# EAGLE design logic (EAGLE 6.2)
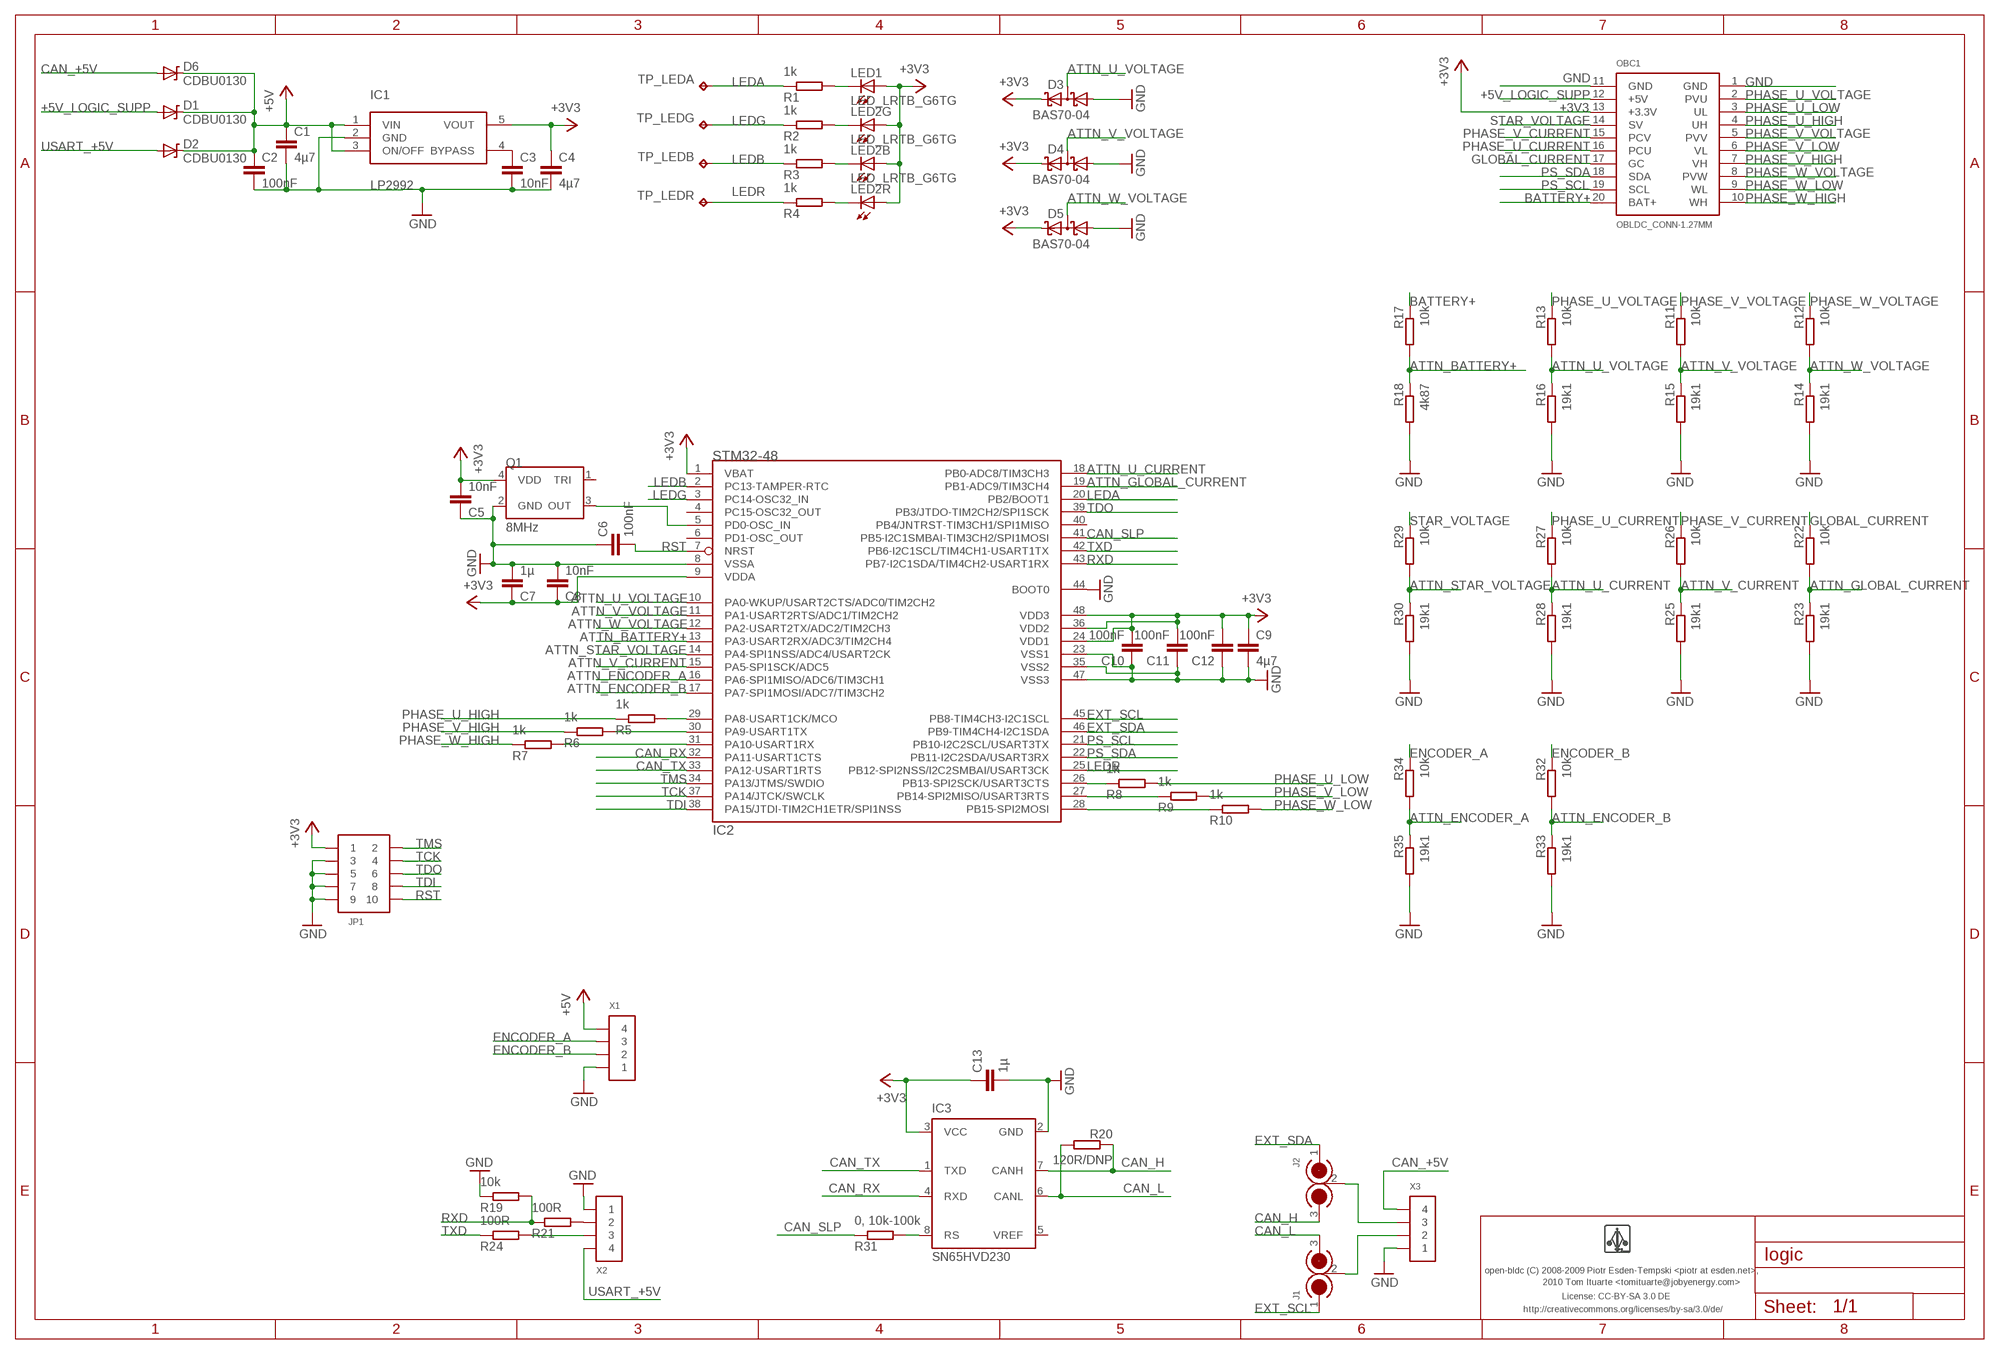
[diagram p0: schematic, sheet 1]

## Parts
C1  4µ7  CAPACITOR-0603  [0603-CAP]
C2  100nF  CAPACITOR-0603  [0603-CAP]
C3  10nF  CAPACITOR-0603  [0603-CAP]
C4  4µ7  CAPACITOR-0603  [0603-CAP]
C5  10nF  CAPACITOR-0603  [0603-CAP]
C6  100nF  CAPACITOR-0603  [0603-CAP]
C7  1µ  CAPACITOR-0603  [0603-CAP]
C8  10nF  CAPACITOR-0603  [0603-CAP]
C9  4µ7  CAPACITOR-0603  [0603-CAP]
C10  100nF  CAPACITOR-0603  [0603-CAP]
C11  100nF  CAPACITOR-0603  [0603-CAP]
C12  100nF  CAPACITOR-0603  [0603-CAP]
C13  1µ  CAPACITOR-0603  [0603-CAP]
D1  CDBU0130  DIODE-ZENER-0603  [0603-LED]
D2  CDBU0130  DIODE-ZENER-0603  [0603-LED]
D3  BAS70-04  [SOT23]
D4  BAS70-04  [SOT23]
D5  BAS70-04  [SOT23]
D6  CDBU0130  DIODE-ZENER-0603  [0603-LED]
IC1  LP2992  [SOT23-5]
IC2  STM32-48  [LQFP48]
IC3  SN65HVD230  [SO8]
J1  CIRC_JMP_2  [CIRC_JMP_2]
J2  CIRC_JMP_2  [CIRC_JMP_2]
JP1  PIN_HDR_EDG_1.27MM_5-2-DH  [PIN_HDR_1.27MM_SMD_DH_10]
LED1  AMBER  LED-0603  [0603-LED]
LED2  LED_LRTB_G6TG  [PLCC6]
OBC1  OBLDC_CONN-1.27MM  [OBLDC_CONN]
Q1  8MHz  ASE_ASCILLATOR  [ASE_OSCILLATOR]
R1  1k  RESISTOR-0603  [0603-RES]
R2  1k  RESISTOR-0603  [0603-RES]
R3  1k  RESISTOR-0603  [0603-RES]
R4  1k  RESISTOR-0603  [0603-RES]
R5  1k  RESISTOR-0603  [0603-RES]
R6  1k  RESISTOR-0603  [0603-RES]
R7  1k  RESISTOR-0603  [0603-RES]
R8  1k  RESISTOR-0603  [0603-RES]
R9  1k  RESISTOR-0603  [0603-RES]
R10  1k  RESISTOR-0603  [0603-RES]
R11  10k  RESISTOR-0603  [0603-RES]
R12  10k  RESISTOR-0603  [0603-RES]
R13  10k  RESISTOR-0603  [0603-RES]
R14  19k1  RESISTOR-0603  [0603-RES]
R15  19k1  RESISTOR-0603  [0603-RES]
R16  19k1  RESISTOR-0603  [0603-RES]
R17  10k  RESISTOR-0603  [0603-RES]
R18  4k87  RESISTOR-0603  [0603-RES]
R19  10k  RESISTOR-0603  [0603-RES]
R20  120R/DNP  RESISTOR-0603  [0603-RES]
R21  100R  RESISTOR-0603  [0603-RES]
R22  10k  RESISTOR-0603  [0603-RES]
R23  19k1  RESISTOR-0603  [0603-RES]
R24  100R  RESISTOR-0603  [0603-RES]
R25  19k1  RESISTOR-0603  [0603-RES]
R26  10k  RESISTOR-0603  [0603-RES]
R27  10k  RESISTOR-0603  [0603-RES]
R28  19k1  RESISTOR-0603  [0603-RES]
R29  10k  RESISTOR-0603  [0603-RES]
R30  19k1  RESISTOR-0603  [0603-RES]
R31  0, 10k-100k  RESISTOR-0603  [0603-RES]
R32  10k  RESISTOR-0603  [0603-RES]
R33  19k1  RESISTOR-0603  [0603-RES]
R34  10k  RESISTOR-0603  [0603-RES]
R35  19k1  RESISTOR-0603  [0603-RES]
TP_LEDA  TP-SMD  [MINI_TESTPAD]
TP_LEDB  TP-SMD  [MINI_TESTPAD]
TP_LEDG  TP-SMD  [MINI_TESTPAD]
TP_LEDR  TP-SMD  [MINI_TESTPAD]
U$1  LOGO  LOGO-NORM  [LOGO]
X1  CONN_4-1-53261  [PB-53261-04]
X2  CONN_4-1-53261  [PB-53261-04]
X3  CONN_4-1-53261  [PB-53261-04]

## Nets
+3V3: C4.P$1 C5.P$2 C7.P$1 C8.P$1 C9.P$1 C10.P$2 C11.P$2 C12.P$2 C13.P$1 D3.2(C2) D4.2(C2) D5.2(C2) IC1.5(VOUT) IC2.1(VBAT) IC2.9(VDDA) IC2.24(VDD1) IC2.36(VDD2) IC2.48(VDD3) IC3.3(VCC) JP1.1 LED1.A LED2.A1(R:A) LED2.A2(G:A) LED2.A3(B:A) OBC1.13(+3.3V) Q1.4(VDD)
+5V: C1.P$1 C2.P$1 D1.C D2.C D6.C IC1.1(VIN) IC1.3(ON/OFF) X1.4
+5V_LOGIC_SUPP: D1.A OBC1.12(+5V)
ATTN_BATTERY+: IC2.13(PA3-USART2RX/ADC3/TIM2CH4) R17.P$2 R18.P$1
ATTN_ENCODER_A: IC2.16(PA6-SPI1MISO/ADC6/TIM3CH1) R34.P$2 R35.P$1
ATTN_ENCODER_B: IC2.17(PA7-SPI1MOSI/ADC7/TIM3CH2) R32.P$2 R33.P$1
ATTN_GLOBAL_CURRENT: IC2.19(PB1-ADC9/TIM3CH4) R22.P$2 R23.P$1
ATTN_STAR_VOLTAGE: IC2.14(PA4-SPI1NSS/ADC4/USART2CK) R29.P$2 R30.P$1
ATTN_U_CURRENT: IC2.18(PB0-ADC8/TIM3CH3) R27.P$2 R28.P$1
ATTN_U_VOLTAGE: D3.3(C1A2) IC2.10(PA0-WKUP/USART2CTS/ADC0/TIM2CH2) R13.P$2 R16.P$1
ATTN_V_CURRENT: IC2.15(PA5-SPI1SCK/ADC5) R25.P$1 R26.P$2
ATTN_V_VOLTAGE: D4.3(C1A2) IC2.11(PA1-USART2RTS/ADC1/TIM2CH2) R11.P$2 R15.P$1
ATTN_W_VOLTAGE: D5.3(C1A2) IC2.12(PA2-USART2TX/ADC2/TIM2CH3) R12.P$2 R14.P$1
BATTERY+: OBC1.20(BAT+) R17.P$1
CAN_+5V: D6.A X3.4
CAN_H: IC3.7(CANH) J2.3 R20.P$1
CAN_L: IC3.6(CANL) J1.3 R20.P$2
CAN_RX: IC2.32(PA11-USART1CTS) IC3.4(RXD)
CAN_SLP: IC2.41(PB5-I2C1SMBAI-TIM3CH2/SPI1MOSI) R31.P$1
CAN_TX: IC2.33(PA12-USART1RTS) IC3.1(TXD)
ENCODER_A: R34.P$1 X1.3
ENCODER_B: R32.P$1 X1.2
EXT_SCL: IC2.45(PB8-TIM4CH3-I2C1SCL) J1.1
EXT_SDA: IC2.46(PB9-TIM4CH4-I2C1SDA) J2.1
GLOBAL_CURRENT: OBC1.17(GC) R22.P$1
GND: C1.P$2 C2.P$2 C3.P$2 C4.P$2 C5.P$1 C6.P$1 C7.P$2 C8.P$2 C9.P$2 C10.P$1 C11.P$1 C12.P$1 C13.P$2 D3.1(A1) D4.1(A1) D5.1(A1) IC1.2(GND) IC2.8(VSSA) IC2.23(VSS1) IC2.35(VSS2) IC2.44(BOOT0) IC2.47(VSS3) IC3.2(GND) JP1.3 JP1.5 JP1.7 JP1.9 OBC1.1(GND) OBC1.11(GND) Q1.2(GND) R14.P$2 R15.P$2 R16.P$2 R18.P$2 R19.P$1 R23.P$2 R25.P$2 R28.P$2 R30.P$2 R33.P$2 R35.P$2 X1.1 X2.1 X3.1
LEDA: IC2.20(PB2/BOOT1) R1.P$1 TP_LEDA.1(TP)
LEDB: IC2.2(PC13-TAMPER-RTC) R3.P$1 TP_LEDB.1(TP)
LEDG: IC2.3(PC14-OSC32_IN) R2.P$1 TP_LEDG.1(TP)
LEDR: IC2.25(PB12-SPI2NSS/I2C2SMBAI/USART3CK) R4.P$1 TP_LEDR.1(TP)
N$1: J2.2 X3.3
N$2: J1.2 X3.2
N$3: LED1.C R1.P$2
N$4: LED2.C1(R:C) R4.P$2
N$5: LED2.C3(B:C) R3.P$2
N$6: R21.P$2 X2.2
N$7: IC3.8(RS) R31.P$2
N$10: LED2.C2(G:C) R2.P$2
N$20: R24.P$2 X2.3
N$22: C3.P$1 IC1.4(BYPASS)
N$33: IC2.26(PB13-SPI2SCK/USART3CTS) R8.P$1
N$36: IC2.27(PB14-SPI2MISO/USART3RTS) R9.P$1
N$39: IC2.28(PB15-SPI2MOSI) R10.P$1
N$40: IC2.5(PD0-OSC_IN) Q1.3(OUT)
N$41: IC2.29(PA8-USART1CK/MCO) R5.P$2
N$42: IC2.30(PA9-USART1TX) R6.P$2
N$45: IC2.31(PA10-USART1RX) R7.P$2
PHASE_U_CURRENT: OBC1.16(PCU) R27.P$1
PHASE_U_HIGH: OBC1.4(UH) R5.P$1
PHASE_U_LOW: OBC1.3(UL) R8.P$2
PHASE_U_VOLTAGE: OBC1.2(PVU) R13.P$1
PHASE_V_CURRENT: OBC1.15(PCV) R26.P$1
PHASE_V_HIGH: OBC1.7(VH) R6.P$1
PHASE_V_LOW: OBC1.6(VL) R9.P$2
PHASE_V_VOLTAGE: OBC1.5(PVV) R11.P$1
PHASE_W_HIGH: OBC1.10(WH) R7.P$1
PHASE_W_LOW: OBC1.9(WL) R10.P$2
PHASE_W_VOLTAGE: OBC1.8(PVW) R12.P$1
PS_SCL: IC2.21(PB10-I2C2SCL/USART3TX) OBC1.19(SCL)
PS_SDA: IC2.22(PB11-I2C2SDA/USART3RX) OBC1.18(SDA)
RST: C6.P$2 IC2.7(NRST) JP1.10
RXD: IC2.43(PB7-I2C1SDA/TIM4CH2-USART1RX) R19.P$2 R21.P$1
STAR_VOLTAGE: OBC1.14(SV) R29.P$1
TCK: IC2.37(PA14/JTCK/SWCLK) JP1.4
TDI: IC2.38(PA15/JTDI-TIM2CH1ETR/SPI1NSS) JP1.8
TDO: IC2.39(PB3/JTDO-TIM2CH2/SPI1SCK) JP1.6
TMS: IC2.34(PA13/JTMS/SWDIO) JP1.2
TXD: IC2.42(PB6-I2C1SCL/TIM4CH1-USART1TX) R24.P$1
USART_+5V: D2.A X2.4
Unconnected: IC2.4(PC15-OSC32_OUT) IC2.6(PD1-OSC_OUT) IC2.40(PB4/JNTRST-TIM3CH1/SPI1MISO) IC3.5(VREF) Q1.1(TRI)

## Notes on the sheet
- open-bldc (C) 2008-2009 Piotr Esden-Tempski <piotr at esden.net>,
- 2010 Tom Ituarte <tomituarte@jobyenergy.com>
- License: CC-BY-SA 3.0 DE
- http://creativecommons.org/licenses/by-sa/3.0/de/

## Library data of the parts
C1-C13 = pel_dipol_comp:CAPACITOR
D1 D2 D6 = pel_dipol_comp:DIODE-ZENER
D3-D5 = diode:BAS70-04: Silicon Schottky Diodes General-purpose diode for high-speed switching
IC1 = open-bldc:LP2992
IC2 = open-bldc:STM32-48
IC3 = open-bldc:SN65HVD230: SN65HVD230 - 3.3V CAN Transceiver - 3.3V operation - ISO 11898 compliant - up to 1Mbps - up to 120 nodes - listen only mode - slope control
J1 J2 = fancy_jumpers:CIRC_JMP_2
JP1 = open-bldc:PIN_HDR_EDG_1.27MM_5-2
LED1 = pel_dipol_comp:LED
LED2 = open-bldc:LED_LRTB_G6TG
OBC1 = open-bldc:OBLDC_CONN
Q1 = open-bldc:ASE_ASCILLATOR
R1-R35 = pel_dipol_comp:RESISTOR
TP_LEDA TP_LEDB TP_LEDG TP_LEDR = open-bldc:TP
U$1 = open-bldc:LOGO
X1-X3 = pel_molex:CONN_4-1

## Board
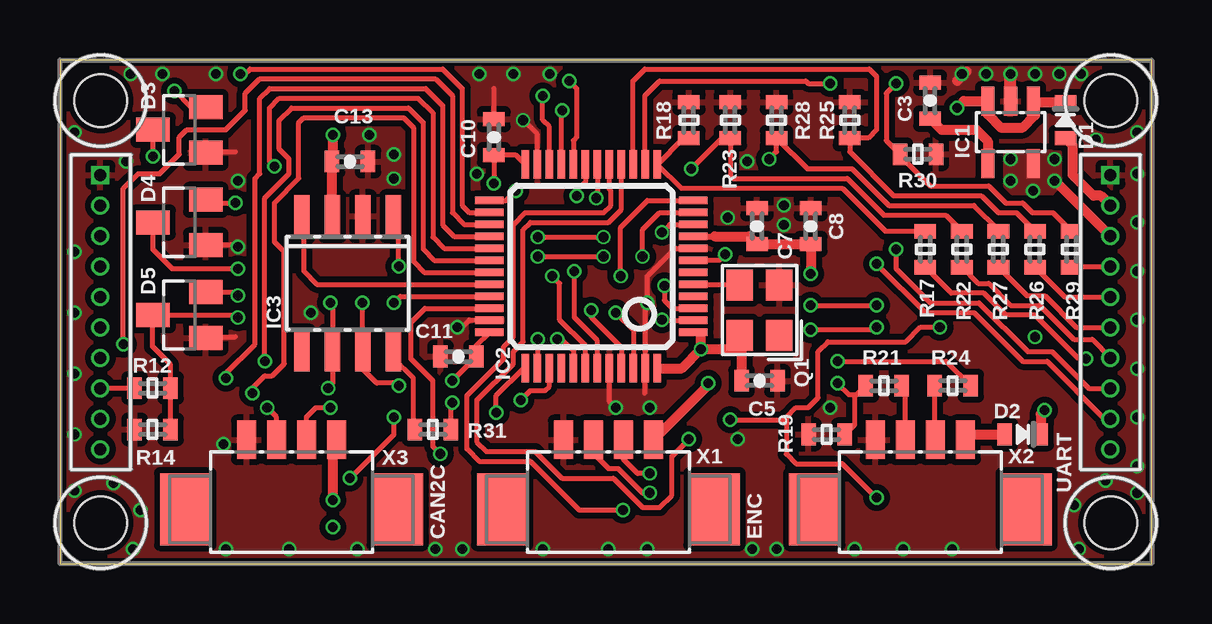
[diagram p1: board, top side]
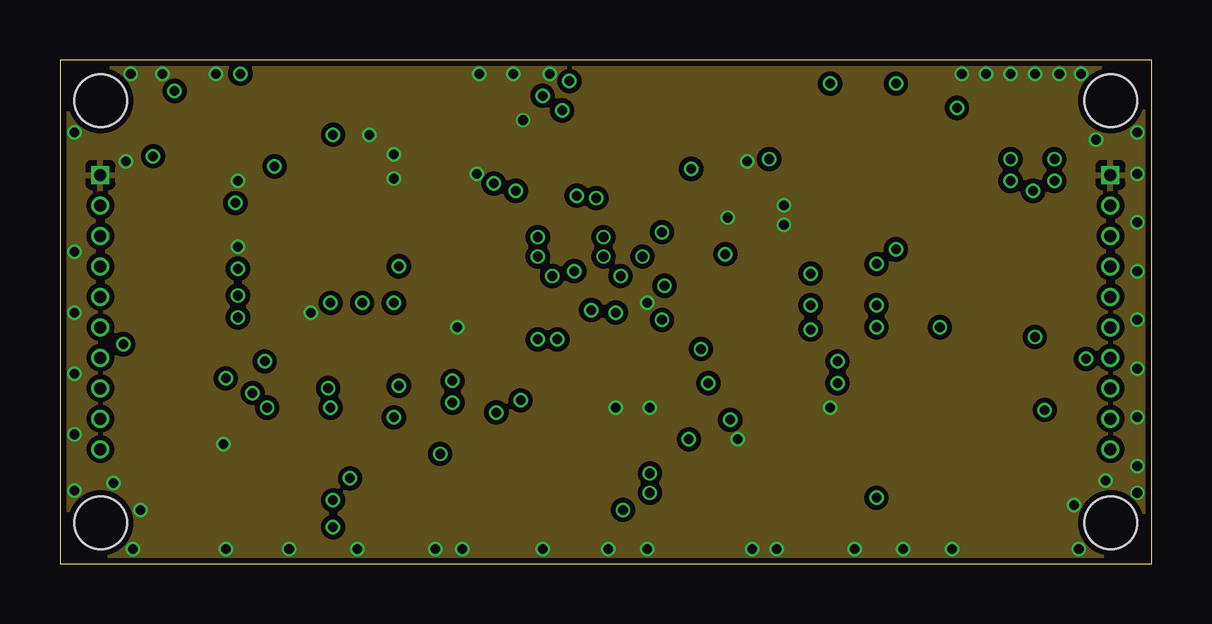
[diagram p2: board, inner layer Route2]
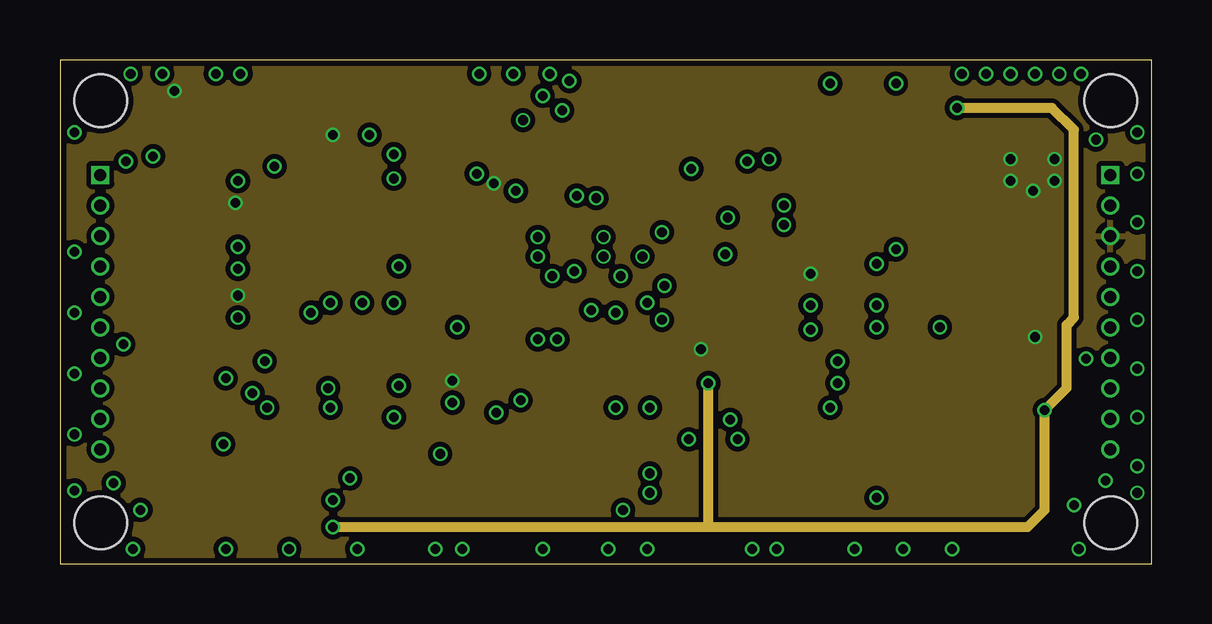
[diagram p3: board, inner layer Route15]
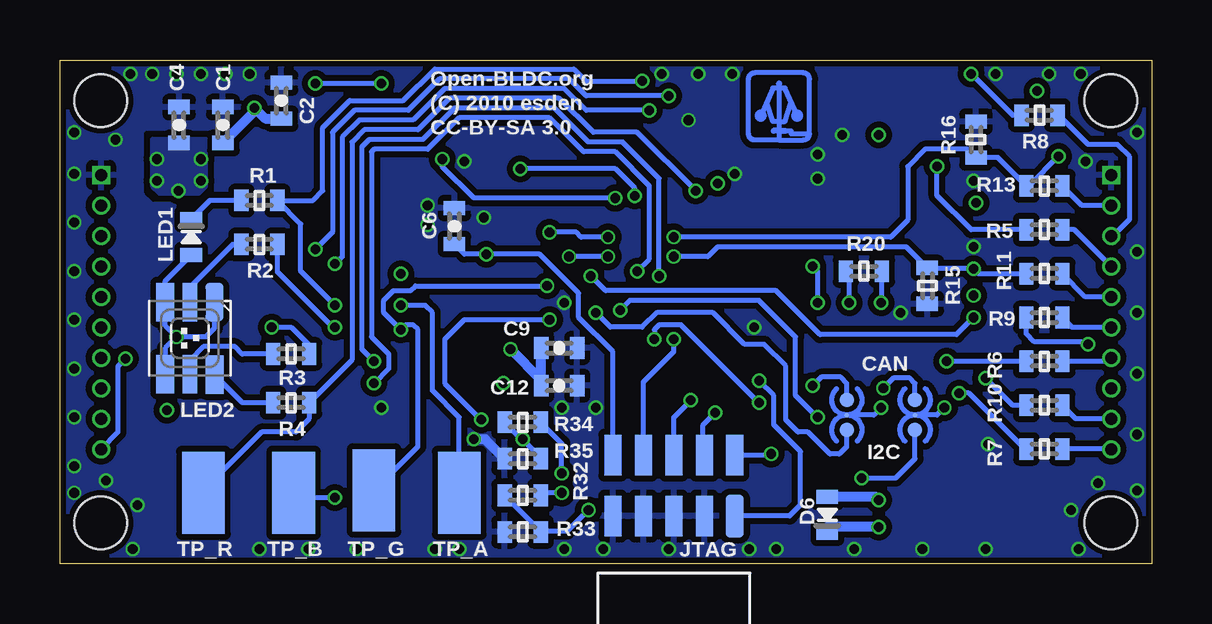
[diagram p4: board, bottom side, seen from below]

Size 45.5 x 21 mm. Coordinates in mm from the lower left corner, seen from the top.
Outline: 0,0 45.5,0 45.5,21 0,21 0,0
Copper layers (1*2+15*16): Top 0.035mm / dielectric 0.75mm / Route2 0.035mm / dielectric 0.15mm / Route15 0.035mm / dielectric 0.75mm / Bottom 0.035mm
Design rules: minimum track width 8mil, minimum drill 0.4mm, track to track 8mil, track to pad 8mil, pad to pad 8mil, via to via 8mil, smd to smd 8mil, copper to edge 10mil, drill to drill 8mil, minimum pad ring 0.1mm, minimum via ring 0.1mm, stop-mask expansion 4mil, vias tented up to drill 16mil, thermal gap 10mil

### Footprints (pad centres in the part's own frame; a part is rotated, then mirrored left to right if it is on the bottom)
0603-CAP = smd 0.6 x 0.9: P$1 -0.75,0; P$2 0.75,0
0603-LED = smd 0.6 x 0.9: A 0.75,0; C -0.75,0
SOT23 = smd 1 x 1.4: 1 -0.95,-1.1; 2 0.95,-1.1; 3 0,1.1
SOT23-5 = smd 0.55 x 1.2: 1 -0.95,-1.3; 2 0,-1.3; 3 0.95,-1.3; 4 0.95,1.3; 5 -0.95,1.3
LQFP48 = smd 0.3 x 1.2: 1 -2.75,-4.25; 2 -2.25,-4.25; 3 -1.75,-4.25; 4 -1.25,-4.25; 5 -0.75,-4.25; 6 -0.25,-4.25; 7 0.25,-4.25; 8 0.75,-4.25; 9 1.25,-4.25; 10 1.75,-4.25; 11 2.25,-4.25; 12 2.75,-4.25; 25 2.75,4.25; 26 2.25,4.25; 27 1.75,4.25; 28 1.25,4.25; 29 0.75,4.25; 30 0.25,4.25; 31 -0.25,4.25; 32 -0.75,4.25; 33 -1.25,4.25; 34 -1.75,4.25; 35 -2.25,4.25; 36 -2.75,4.25 | smd 1.2 x 0.3: 13 4.25,-2.75; 14 4.25,-2.25; 15 4.25,-1.75; 16 4.25,-1.25; 17 4.25,-0.75; 18 4.25,-0.25; 19 4.25,0.25; 20 4.25,0.75; 21 4.25,1.25; 22 4.25,1.75; 23 4.25,2.25; 24 4.25,2.75; 37 -4.25,2.75; 38 -4.25,2.25; 39 -4.25,1.75; 40 -4.25,1.25; 41 -4.25,0.75; 42 -4.25,0.25; 43 -4.25,-0.25; 44 -4.25,-0.75; 45 -4.25,-1.25; 46 -4.25,-1.75; 47 -4.25,-2.25; 48 -4.25,-2.75
SO8 = smd 0.65 x 1.75: 1 -1.905,-2.8; 2 -0.635,-2.8; 3 0.635,-2.8; 4 1.905,-2.8; 5 1.905,2.8; 6 0.635,2.8; 7 -0.635,2.8; 8 -1.905,2.8
CIRC_JMP_2 = smd 0.61 x 0.61: 1 0,-0.617; 3 0,0.617 | smd 0.203 x 0.203: 2 0,0
PIN_HDR_1.27MM_SMD_DH_10 = smd 1.78 x 0.76: 1 -1.27,-2.54 | smd 1.702 x 0.711: 2 1.27,-2.54; 3 -1.27,-1.27; 4 1.27,-1.27; 5 -1.27,0; 6 1.27,0; 7 -1.27,1.27; 8 1.27,1.27; 9 -1.27,2.54; 10 1.27,2.54
PLCC6 = smd 0.75 x 1.6: A1 -1.025,-1.5; A2 1.025,-1.5; A3 1.025,1.5; C1 -1.025,1.525 | smd 0.6 x 1.6: C2 0,-1.5; C3 0,1.5
OBLDC_CONN = drill 0.5 square: 1 1.685,16.2; 11 43.788,16.2 | drill 0.5: 2 1.685,14.93; 3 1.685,13.66; 4 1.685,12.39; 5 1.685,11.12; 6 1.685,9.85; 7 1.685,8.58; 8 1.685,7.31; 9 1.685,6.04; 10 1.685,4.77; 12 43.788,14.93; 13 43.788,13.66; 14 43.788,12.39; 15 43.788,11.12; 16 43.788,9.85; 17 43.788,8.58; 18 43.788,7.31; 19 43.788,6.04; 20 43.788,4.77 | hole 2.2: 1.7,1.7; 1.7,19.3; 43.8,1.7; 43.8,19.3
ASE_OSCILLATOR = smd 1.3 x 1.1: 1 -1.05,-0.825; 2 1.05,-0.825; 3 1.05,0.825; 4 -1.05,0.825
0603-RES = smd 0.6 x 0.9: P$1 -0.75,0; P$2 0.75,0
MINI_TESTPAD = smd 3.429 x 1.778: 1 0,0
PB-53261-04 = smd 0.8 x 1.6: 1 -1.875,1.1; 2 -0.625,1.1; 3 0.625,1.1; 4 1.875,1.1 | smd 2.1 x 3: MNT1 -4.425,-1.8; MNT2 4.425,-1.8

### Placement (x,y rotation side)
C1  38.71,18.29 90 bottom
C2  36.27,19.3 90 bottom
C3  36.27,19.3 90 top
C4  40.54,18.29 90 bottom
C5  29.16,7.62 180 top
C6  29.06,14.07 270 bottom
C7  29.06,14.07 90 top
C8  31.29,14.07 90 top
C9  24.69,8.99 0 bottom
C10  18.08,17.78 270 top
C11  16.61,8.64 0 top
C12  24.69,7.42 180 bottom
C13  12.09,16.76 0 top
D1  41.91,18.49 270 top
D2  40.13,5.38 180 top
D3  4.98,18.08 90 top
D4  4.98,14.22 90 top
D5  4.98,10.36 90 top
D6  13.51,2.03 90 bottom
IC1  39.62,17.98 180 top
IC2  22.15,12.4 90 top
IC3  11.99,11.68 180 top
J1  9.86,6.2 0 bottom
J2  12.7,6.2 0 bottom
JP1  19.91,3.25 90 bottom
LED1  40.03,13.61 270 bottom
LED2  40.08,9.4 180 bottom
OBC1  0,0 0 top
Q1  29.16,10.57 90 top
R1  37.19,15.14 180 bottom
R2  37.19,13.31 180 bottom
R3  35.86,8.74 180 bottom
R4  35.86,6.71 180 bottom
R5  4.47,13.92 180 bottom
R6  4.47,8.43 180 bottom
R7  4.47,4.78 180 bottom
R8  4.67,18.69 0 bottom
R9  4.47,10.26 0 bottom
R10  4.47,6.6 0 bottom
R11  4.47,12.09 180 bottom
R12  3.86,7.32 0 top
R13  4.47,15.75 180 bottom
R14  3.86,5.59 180 top
R15  9.35,11.58 270 bottom
R16  7.32,17.68 90 bottom
R17  36.07,13.11 90 top
R18  26.21,18.49 90 top
R19  31.95,5.38 0 top
R20  11.99,12.19 0 bottom
R21  34.34,7.42 0 top
R22  37.59,13.11 90 top
R23  27.94,18.49 90 top
R24  37.21,7.42 180 top
R25  32.92,18.49 90 top
R26  40.64,13.11 90 top
R27  39.12,13.11 90 top
R28  29.87,18.49 90 top
R29  42.16,13.11 90 top
R30  35.76,17.07 0 top
R31  15.54,5.59 180 top
R32  26.21,2.84 180 bottom
R33  26.21,1.32 180 bottom
R34  26.21,5.89 180 bottom
R35  26.21,4.37 180 bottom
TP_LEDA  28.85,2.95 90 bottom
TP_LEDB  35.76,2.95 90 bottom
TP_LEDG  32.41,3.05 90 bottom
TP_LEDR  39.52,2.95 90 bottom
U$1  15.54,18.95 0 bottom
X1  22.86,4.06 0 top
X2  35.86,4.06 0 top
X3  9.65,4.06 0 top

### Tracks (layer width: path | path; a pad name or v marks a point on that pad's centre or on a via)
+3V3  (via drill 0.4)
  Top 0.203: 6.22,11.18 D5.2 7.28,11.31 v7.42,11.18 | v18.09,15.85 C10.P$2 19.01,17.03 IC2.24 | v7.32,15.04 6.08,15.04 D4.2 | 11.34,14.3 IC3.3 | 26.72,9.57 26.47,9.57 IC2.1 | v4.78,19.71 5.45,19.04 D3.2 | IC2.36 17.36,9.11 C11.P$2 16.36,7.63 v16.36,7.62 | IC2.48 24.99,8.14
  Top 0.254: IC2.9 27.3,13.64
  Top 0.406: v26.72,8.94 26.72,9.57 | v26.72,8.94 26.62,8.94 | v26.72,8.94 28.26,8.94 | v31.29,12.09 C8.P$1 C7.P$1 28.73,13.64 27.3,13.64 | C5.P$2 28.41,8.79 28.26,8.94 | 28.26,8.94 28.26,9.44 Q1.4 | v26.72,8.94 25.93,8.14 24.99,8.14 | 11.34,14.3 C13.P$1 11.38,16.76 v11.38,17.88 | OBC1.13 41.5,15.95 v41.45,15.95
  Bottom 0.203: LED2.A1 39.06,9.81 39.42,9.45 v40.64,9.45 | v40.64,9.45 41.11,9.91 LED2.A2 41.11,11.79 LED1.A | LED2.A3 41.11,8.98 v40.64,9.45 | JP1.1 15.09,1.98 14.63,2.44 14.63,4.67 15.75,5.79 15.75,6.81 15.75,7.01 v16.36,7.62
  Bottom 0.406: C9.P$1 C12.P$2 25.44,7.66 v26.72,8.94
  other vias: 41.45,16.87 39.62,16.87 39.62,15.95 40.56,15.54
  pour Route15: 0,0 0,21.03 45.52,21.03 45.52,0
  pour Top (isolate 0.203, no thermals): 39.42,17.17 41.66,17.17 41.66,15.75 41.35,15.44 39.73,15.44 39.42,15.75
  pour Bottom (isolate 0.203, no thermals): 39.42,17.68 41.66,17.68 41.66,15.75 41.35,15.44 39.73,15.44 39.42,15.75
+5V  (via drill 0.4)
  Top 0.406: v37.39,19 37.67,19.28 IC1.3 38.67,18.73 39.22,18.19 40.13,18.19 40.64,18.69 40.64,19.22 IC1.1 40.62,19.24 D1.C | D2.C 40.88,6.24 v41.05,6.4 | X1.4 27.03,7.46 v27.03,7.52
  Route15 0.406: 27.03,1.52 40.34,1.52 41.05,2.23 v41.05,6.4 41.96,7.32 41.96,9.96 42.27,10.26 42.27,18.09 41.35,19 v37.39,19 | v11.38,1.52 27.03,1.52 | 27.03,1.52 v27.03,7.52
  Bottom 0.406: C2.P$1 36.94,18.55 v37.39,19 37.39,18.86 C1.P$1 | v11.38,1.52 13.51,1.52 D6.C
+5V_LOGIC_SUPP
  Top 0.406: OBC1.12 43.38,15.34 43.08,15.34 42.22,16.2 42.22,17.44 D1.A
ATTN_BATTERY+
  Top 0.203: R17.P$2 34.4,13.86 32.61,15.65 25.9,15.65 IC2.13 26,17.74 R18.P$1
ATTN_ENCODER_A  (via drill 0.4)
  Top 0.203: v26.21,5.18 25.5,4.47 25.5,2.85 24.99,2.34 24.28,2.34 23.06,3.56 20.93,3.56 19.81,4.67 17.78,4.67 17.37,5.08 17.37,6.81 18.9,8.33 18.9,8.84 19.3,9.25 19.3,13.92 19.61,14.22 22.86,14.22 23.4,14.76 IC2.16
  Bottom 0.203: v26.21,5.18 26.21,5.14 | R34.P$2 26.25,5.18 v26.21,5.18 | R35.P$1 25.46,4.43 v26.21,5.18
ATTN_ENCODER_B  (via drill 0.4)
  Top 0.203: v23.47,2.23 21.64,2.23 19.61,4.27 17.48,4.27 16.97,4.78 16.97,7.01 18.49,8.53 18.49,9.04 18.9,9.45 18.9,14.12 19.41,14.63 22.66,14.63 22.96,14.94 22.96,15.54 22.9,15.61 IC2.17
  Bottom 0.203: 25.46,1.34 R33.P$1 | 25.46,1.34 R32.P$2 | 25.46,1.34 24.36,1.34 v23.47,2.23
ATTN_GLOBAL_CURRENT  (via drill 0.4)
  Top 0.203: v26.31,16.46 27.6,17.74 R23.P$1 27.94,16.15 28.04,16.05 32.82,16.05 34.34,14.53 36.92,14.53 R22.P$2 | v21.54,15.34 21.54,15.54 21.9,15.9 IC2.19
  Bottom 0.203: v26.31,16.46 22.35,16.46 21.54,15.65 v21.54,15.34
ATTN_STAR_VOLTAGE  (via drill 0.4)
  Top 0.203: IC2.14 24.38,16.66 24.38,19.51 24.99,20.12 31.09,20.12 31.19,20.02 v32.11,20.02 | R29.P$2 41.39,14.63 40.54,14.63 40.13,15.04 39.42,15.04 38.71,15.75 36.27,15.75 35.01,17.01 R30.P$1 34.44,17.64 34.44,19.61 v34.85,20.02
  Bottom 0.203: v32.11,20.02 v34.85,20.02
ATTN_U_CURRENT  (via drill 0.4)
  Top 0.203: v29.57,16.87 29.87,17.17 R28.P$1 31.15,16.46 33.02,16.46 34.54,14.94 38.1,14.94 39.12,13.92 R27.P$2 | v22.35,15.24 22.4,15.29 IC2.18
  Bottom 0.203: v29.57,16.87 29.57,16.56 28.25,15.24 v22.35,15.24
ATTN_U_VOLTAGE  (via drill 0.4)
  Top 0.203: 3.86,18.07 D3.3 v3.88,16.98 3.86,16.97 | v19.91,13.61 v22.66,13.61 | v25.09,13.82 25.42,14.14 IC2.10
  Bottom 0.203: R13.P$2 5.08,15.75 | v3.88,16.98 5.12,15.75 R13.P$2 | R13.P$2 6.4,16.93 R16.P$1 7.66,17.27 9.45,17.27 10.16,16.56 10.16,14.33 10.87,13.61 v19.91,13.61 | v22.66,13.61 23.77,13.61 23.98,13.82 v25.09,13.82
ATTN_V_CURRENT
  Top 0.203: IC2.15 23.88,16.67 23.88,20.12 24.38,20.62 33.73,20.62 34.04,20.32 34.04,18.09 33.69,17.74 R25.P$1 32.92,17.17 34.75,15.34 38.41,15.34 39.12,14.63 39.87,14.63 R26.P$2
ATTN_V_VOLTAGE  (via drill 0.4)
  Top 0.203: v7.42,12.29 4.67,12.29 3.88,13.09 D4.3 | v19.91,12.8 v22.66,12.8 | v24.28,12.8 24.28,13.92 24.99,14.63 25.09,14.63 26.38,14.63 IC2.11
  Bottom 0.203: R11.P$2 7.21,12.09 v7.42,12.29 9.31,12.29 R15.P$1 10.22,13.21 18.09,13.21 18.49,12.8 v19.91,12.8 | v22.66,12.8 v24.28,12.8
ATTN_W_VOLTAGE  (via drill 0.4)
  Top 0.203: R14.P$1 R12.P$2 4.61,8.29 3.86,9.04 3.86,10.35 D5.3 7.32,10.36 v7.42,10.26 | v23.37,11.99 23.37,14.02 24.49,15.14 26.39,15.14 IC2.12
  Bottom 0.203: v7.42,10.26 8.13,9.55 13.82,9.55 15.65,11.38 22.76,11.38 v23.37,11.99
BATTERY+  (via drill 0.4)
  Top 0.203: R17.P$1 37.15,11.28 38.51,11.28 39.42,10.36 40.64,10.36 42.47,8.53 v42.77,8.53
  Bottom 0.203: OBC1.20 43.08,5.48 43.08,5.49 43.08,8.23 v42.77,8.53
CAN_+5V  (via drill 0.4)
  Top 0.406: X3.4 11.38,5.02 v11.38,2.64
  Bottom 0.406: 13.46,2.73 D6.A 11.52,2.78 v11.38,2.64
CAN_H  (via drill 0.4)
  Top 0.203: v12.6,10.87 12.62,10.85 IC3.7 12.62,8.11 13.21,7.53 14.01,7.53 v14.12,7.42
  Bottom 0.203: v12.6,10.87 12.6,12.05 R20.P$1 | J2.3 12.7,7.52 12.96,7.78 13.76,7.78 v14.12,7.42
CAN_L  (via drill 0.4)
  Top 0.203: v11.28,10.87 11.38,10.77 11.38,8.91 IC3.6 11.38,8.86 11.38,7.52 v11.18,7.32
  Bottom 0.203: v11.18,7.32 10.76,7.73 10.07,7.73 9.86,7.52 J1.3 | R20.P$2 11.24,10.91 v11.28,10.87
CAN_RX
  Top 0.203: IC2.32 10.71,11.64 10.16,12.19 10.16,14.41 IC3.4
CAN_SLP  (via drill 0.4)
  Top 0.203: R31.P$1 16.3,6.64 v16.36,6.71 | IC2.41 21.4,8.88 20.93,9.35 v20.73,9.35
  Bottom 0.203: v16.36,6.71 19.61,9.96 20.52,9.96 20.73,9.75 v20.73,9.35
CAN_TX  (via drill 0.4)
  Top 0.203: IC2.33 14.19,11.14 v13.92,10.87 | v14.12,12.39 14.12,14.26 IC3.1
  Bottom 0.203: v13.92,10.87 13.92,12.19 v14.12,12.39
ENCODER_A  (via drill 0.4)
  Top 0.203: v24.59,3.76 24.08,3.76 23.48,4.35 X1.3
  Bottom 0.203: R34.P$1 24.59,5.02 v24.59,3.76
ENCODER_B  (via drill 0.4)
  Top 0.203: X1.2 22.23,4.59 22.86,3.96 23.27,3.96 24.28,2.95 v24.59,2.95
  Bottom 0.203: v24.59,2.95 25.36,2.95 R32.P$1
EXT_SCL  (via drill 0.4)
  Top 0.203: v22.15,10.57 22.15,10.26 23.4,9.01 IC2.45 | v13.92,6.1 13.92,5.38 v12.09,3.56
  Bottom 0.203: v13.92,6.1 14.83,7.01 14.83,9.45 16.36,10.97 21.74,10.97 v22.15,10.57 | J1.1 9.86,4.37 10.67,3.56 v12.09,3.56
EXT_SDA  (via drill 0.4)
  Top 0.203: 23.88,8.17 IC2.46 23.9,9.73 v23.16,10.46
  Bottom 0.203: v23.16,10.46 22.55,9.86 21.23,9.86 20.62,10.46 18.29,10.46 16.97,9.14 16.15,9.14 15.24,8.23 15.24,5.99 14.73,5.49 14.33,5.49 13.4,4.56 13.01,4.56 12.7,4.88 J2.1
GLOBAL_CURRENT
  Top 0.203: R22.P$1 38.26,11.68 38.71,11.68 39.62,10.77 40.84,10.77 42.27,9.35 43.02,9.35 OBC1.17
GND  (via drill 0.4)
  Top 0.203: D3.1 6.11,17.17 7.32,17.17 | D4.1 6.11,13.31 7.32,13.31 | D5.1 6.11,9.45 7.32,9.45 | C10.P$1 18.09,19.81 | 24.38,8.14 IC2.47 24.4,10.78 v24.49,10.87 24.49,11.99 25.2,12.7 25.64,13.14 IC2.8 26.36,13.11 | IC2.23 19.9,17.9 v19.3,18.49 | IC2.35 17.88,10.16 17.07,10.16 16.76,9.86 v16.56,9.86 | 24.38,7.11 24.38,8.13 | IC2.44 22.9,6.77 v23.16,6.5
  Top 0.406: 37.39,20.12 37.8,20.52
  Top 0.508: 39.62,19.2 v39.62,20.42
  Bottom 0.406: v28.25,5.18 27.78,5.18 R35.P$2
  other vias: 12.9,17.88 42.57,20.42 6.81,4.98 28.65,16.76 32.11,6.5 27.84,14.43 10.46,10.46 7.42,15.95 7.42,13.21 0.61,13 0.61,10.46 0.61,7.92 0.61,5.38 0.61,3.05 2.24,3.35 3.05,0.61 6.91,0.61 9.55,0.61 12.4,0.61 15.65,0.61 16.76,0.61 20.12,0.61 22.86,0.61 24.49,0.61 28.85,0.61 29.87,0.61 33.12,0.61 35.15,0.61 37.19,0.61 42.47,0.61 42.27,2.44 43.59,3.45 44.91,4.06 44.91,6.1 44.91,8.13 44.91,10.16 44.91,12.19 44.91,14.22 44.91,16.26 44.91,17.98 43.18,17.68 37.59,20.42 20.42,20.42 18.9,20.42 17.48,20.42 17.37,16.26 6.5,20.42 4.27,20.42 2.95,20.42 0.61,17.98 3.35,2.24 2.74,16.76 44.91,2.95 38.61,20.42 40.64,20.42 41.66,20.42 30.18,14.12 30.18,14.94 13.92,16.05 13.92,17.07 24.59,6.5
  pour Top (isolate 0.254, rank 6): 0,0 0,21.03 45.52,21.03 45.52,0
  pour Bottom (isolate 0.254, rank 6): 0,0 0,21.03 45.52,21.03 45.52,0
  pour Route2: 0,0 0,21.03 45.52,21.03 45.52,0
LEDA  (via drill 0.4)
  Top 0.203: v31.29,10.77 v34.04,10.77 | v21.23,20.12 21.54,19.81 21.54,17.78 21.4,17.64 IC2.20
  Bottom 0.203: v34.04,10.77 35.46,12.19 35.46,14.16 R1.P$1 34.95,15.14 34.54,15.54 34.54,18.19 33.43,19.3 31.19,19.3 29.87,20.62 24.08,20.62 23.57,20.12 v21.23,20.12 | v31.29,10.77 30.28,10.77 29.97,10.46 29.97,7.21 28.85,6.1 TP_LEDA.1
LEDB  (via drill 0.4)
  Top 0.203: v36.68,9.86 35.87,9.86 35.26,9.25 32,9.25 31.6,8.84 31.6,6.91 31.19,6.5 30.68,6.5 30.28,6.1 | 30.28,6.1 30.28,4.57 30.68,4.17 32.61,4.17 v34.04,2.74 | IC2.2 25.11,10.14 v25.09,10.16 | v27.94,5.99 30.18,5.99 30.28,6.1
  Bottom 0.203: R3.P$1 35.12,9.11 35.87,9.86 v36.68,9.86 | v25.09,10.16 28.65,10.16 29.46,9.35 29.46,7.52 v27.94,5.99 | v34.04,2.74 35.56,2.74 TP_LEDB.1
LEDG  (via drill 0.4)
  Top 0.203: v34.04,9.86 33.93,9.75 v31.29,9.75 | IC2.3 25.52,10.64 25.2,10.97 v25.2,11.58
  Bottom 0.203: R2.P$1 36.44,12.15 34.14,9.86 v34.04,9.86 | TP_LEDG.1 30.58,4.88 30.58,9.75 30.79,9.96 31.09,9.96 v31.29,9.75 32,10.46 32,10.97 31.6,11.38 30.89,11.38 30.68,11.58 v25.2,11.58
LEDR  (via drill 0.4)
  Top 0.203: IC2.25 18.6,15.14 v19,15.54
  Bottom 0.203: v19,15.54 21.44,17.98 23.27,17.98 24.69,19.41 29.26,19.41 30.58,18.09 32.82,18.09 33.33,17.58 33.33,8.5 R4.P$1 35.12,6.03 35.66,5.49 37.08,5.49 39.52,3.05 TP_LEDR.1
N$1  (via drill 0.4)
  Top 0.203: v11.28,6.5 10.67,6.5 10.28,6.11 X3.3
  Bottom 0.203: J2.2 11.58,6.2 v11.28,6.5
N$2  (via drill 0.4)
  Top 0.203: v8.64,6.5 9.03,6.11 X3.2
  Bottom 0.203: J1.2 8.94,6.2 v8.64,6.5
N$3
  Bottom 0.203: R1.P$2 39.26,15.14 LED1.C
N$4
  Bottom 0.203: LED2.C1 37.89,6.71 R4.P$2
N$5
  Bottom 0.203: LED2.C3 40.08,8.48 39.52,9.04 38.2,9.04 37.9,8.74 R3.P$2
N$6
  Top 0.203: X2.2 35.24,7.27 R21.P$2
N$7
  Top 0.203: IC3.8 13.89,8.56 14.73,7.72 14.73,5.65 R31.P$2
N$10
  Bottom 0.203: LED2.C2 40.08,11.53 38.3,13.31 R2.P$2
N$20
  Top 0.203: X2.3 36.46,5.16 R24.P$2
N$22
  Top 0.406: IC1.4 38.67,17.61 38.2,18.09 36.74,18.09 C3.P$1
N$33  (via drill 0.4)
  Top 0.203: IC2.26 17.05,14.64 16.76,14.94 16.76,19.81 15.95,20.62 7.92,20.62 7.72,20.42 v7.52,20.42
  Bottom 0.203: v7.52,20.42 5.79,18.69 R8.P$1
N$36  (via drill 0.4)
  Top 0.203: IC2.27 16.84,14.14 16.36,14.63 16.36,19.51 15.65,20.22 8.33,20.22 7.72,19.61 7.72,18.9 6.91,18.09 5.28,18.09 4.98,17.78 4.98,17.07 4.17,16.26 3.25,16.26 2.64,15.65 v2.64,9.14
  Bottom 0.203: R9.P$1 5.22,9.59 4.88,9.25 2.74,9.25 v2.64,9.14
N$39  (via drill 0.4)
  Top 0.203: IC2.28 16.43,13.64 15.95,14.12 15.95,19.1 15.24,19.81 8.74,19.81 8.33,19.41 8.33,16.26 8.13,16.05 8.13,9.14 6.91,7.92 v6.91,7.72
  Bottom 0.203: R10.P$1 5.79,6.6 v6.91,7.72
N$40
  Top 0.203: IC2.5 28.22,11.64 28.25,11.62 Q1.3
N$41  (via drill 0.4)
  Top 0.203: IC2.29 16.01,13.14 15.54,13.61 15.54,18.8 14.94,19.41 9.14,19.41 8.74,19 8.74,16.76 v8.94,16.56
  Bottom 0.203: R5.P$2 7.52,13.92 8.94,15.34 v8.94,16.56
N$42  (via drill 0.4)
  Top 0.203: IC2.30 15.6,12.64 15.14,13.11 15.14,18.39 14.53,19 9.65,19 9.14,18.49 9.14,17.27 9.55,16.87 9.55,16.26 8.53,15.24 v8.53,8.43
  Bottom 0.203: R6.P$2 v8.53,8.43
N$45  (via drill 0.4)
  Top 0.203: IC2.31 15.19,12.14 14.73,12.6 14.73,18.19 14.33,18.59 10.16,18.59 9.96,18.39 9.96,16.05 8.94,15.04 8.94,13.41 9.35,13.01 9.35,8.33 8.84,7.82 8.53,7.82 8.03,7.32 v8.03,7.11
  Bottom 0.203: v8.03,7.11 7.62,7.11 5.28,4.78 R7.P$2
PHASE_U_CURRENT
  Top 0.203: OBC1.16 42.37,9.85 41.05,11.18 40.3,11.18 R27.P$1
PHASE_U_HIGH
  Bottom 0.203: R5.P$1 3.21,13.92 OBC1.4
PHASE_U_LOW
  Bottom 0.203: OBC1.3 1.61,13.66 0.91,14.36 0.91,16.97 1.42,17.48 2.64,17.48 3.86,18.69 R8.P$2
PHASE_U_VOLTAGE
  Bottom 0.203: R13.P$1 2.9,14.93 OBC1.2
PHASE_V_CURRENT
  Top 0.203: OBC1.15 43.64,11.12 41.88,11.12 R26.P$1
PHASE_V_HIGH
  Bottom 0.203: R6.P$1 1.83,8.43 OBC1.7
PHASE_V_LOW
  Bottom 0.203: R9.P$2 3.31,9.85 OBC1.6
PHASE_V_VOLTAGE
  Bottom 0.203: R11.P$1 2.75,11.12 OBC1.5
PHASE_W_HIGH
  Bottom 0.203: OBC1.10 R7.P$1
PHASE_W_LOW
  Bottom 0.203: R10.P$2 3.16,6.04 OBC1.9
PHASE_W_VOLTAGE
  Top 0.203: R12.P$1 OBC1.8
PS_SCL  (via drill 0.4)
  Top 0.203: OBC1.19 43.54,6.04 41.15,8.43 40.13,8.43 38.1,10.46 36.07,10.46 v34.04,12.5 | v20.93,18.9 20.9,18.87 IC2.21
  Bottom 0.203: v34.04,12.5 33.73,12.8 33.73,17.78 33.02,18.49 30.79,18.49 29.46,19.81 24.49,19.81 23.57,18.9 v20.93,18.9
PS_SDA  (via drill 0.4)
  Top 0.203: OBC1.18 42.88,7.31 41.35,8.84 40.34,8.84 38.3,10.87 36.27,10.87 34.85,12.29 v34.85,13.11 | v20.12,19.51 20.12,18.49 20.4,18.21 IC2.22
  Bottom 0.203: v34.85,13.11 34.14,13.82 34.14,17.98 33.22,18.9 30.99,18.9 29.67,20.22 24.28,20.22 23.57,19.51 v20.12,19.51
RST  (via drill 0.4)
  Top 0.203: IC2.7 27.48,12.64 v27.74,12.9
  Bottom 0.203: JP1.10 22.45,8.84 23.88,10.26 23.88,11.28 24.99,12.39 25.5,12.9 v27.74,12.9 28.64,12.9 C6.P$2
RXD  (via drill 0.4)
  Top 0.203: 33.12,7.05 33.12,5.79 32.72,5.38 R19.P$2 | v32.41,7.52 32.88,7.05 33.12,7.05 | R21.P$1 33.22,7.05 33.12,7.05 | v21.44,12.19 21.44,10.26 22.4,9.3 IC2.43
  Bottom 0.203: v32.41,7.52 31.8,8.13 31.8,8.74 32.51,9.45 32.51,17.17 32.41,17.27 30.18,17.27 28.85,18.59 25.09,18.59 23.67,17.17 22.35,17.17 20.93,15.75 20.93,12.7 v21.44,12.19
STAR_VOLTAGE
  Top 0.203: OBC1.14 42.2,12.39 R29.P$1
TCK  (via drill 0.4)
  Top 0.203: v18.19,6.3 18.19,7.01 19.32,8.14 IC2.37
  Bottom 0.203: JP1.4 18.69,4.47 18.69,5.79 v18.19,6.3
TDI  (via drill 0.4)
  Top 0.203: 19.91,7.88 19.9,7.88 IC2.38 19.9,9.33 v19.91,9.35
  Bottom 0.203: JP1.8 21.18,7.57 19.91,8.84 v19.91,9.35
TDO  (via drill 0.4)
  Top 0.203: IC2.39 20.4,7.39 20.22,7.21 19.61,7.21 v19.2,6.81
  Bottom 0.203: JP1.6 19.91,6.1 v19.2,6.81
TMS  (via drill 0.4)
  Top 0.203: IC2.34 15.22,10.64 14.63,10.06 14.63,8.53 15.54,7.62 15.54,4.88 v15.85,4.57
  Bottom 0.203: JP1.2 15.9,4.52 v15.85,4.57
TXD  (via drill 0.4)
  Top 0.203: v32.41,8.43 36.95,8.43 R24.P$1 | v20.52,11.99 20.83,11.68 20.83,10.16 21.9,9.09 IC2.42
  Bottom 0.203: v32.41,8.43 32.92,8.94 32.92,17.37 32.61,17.68 30.38,17.68 29.06,19 24.89,19 23.47,17.58 22.05,17.58 20.52,16.05 v20.52,11.99
USART_+5V
  Top 0.406: X2.4 37.96,5.38 D2.A

### Text on the board
tNames: I2C | UART | CAN | ENC
bNames: Open-BLDC.org | (C) 2010 esden | CC-BY-SA 3.0 | CAN | I2C | JTAG | TP_A | TP_G | TP_B | TP_R